# EasyEDA schematic 1-Schematic_Placa Final ALS.json
TITLE: Sheet_1; REV: 1.0; Date: 2024-05-12; Sheet: 1/1; Drawn By: Fernando Freitas; Company: Your Company
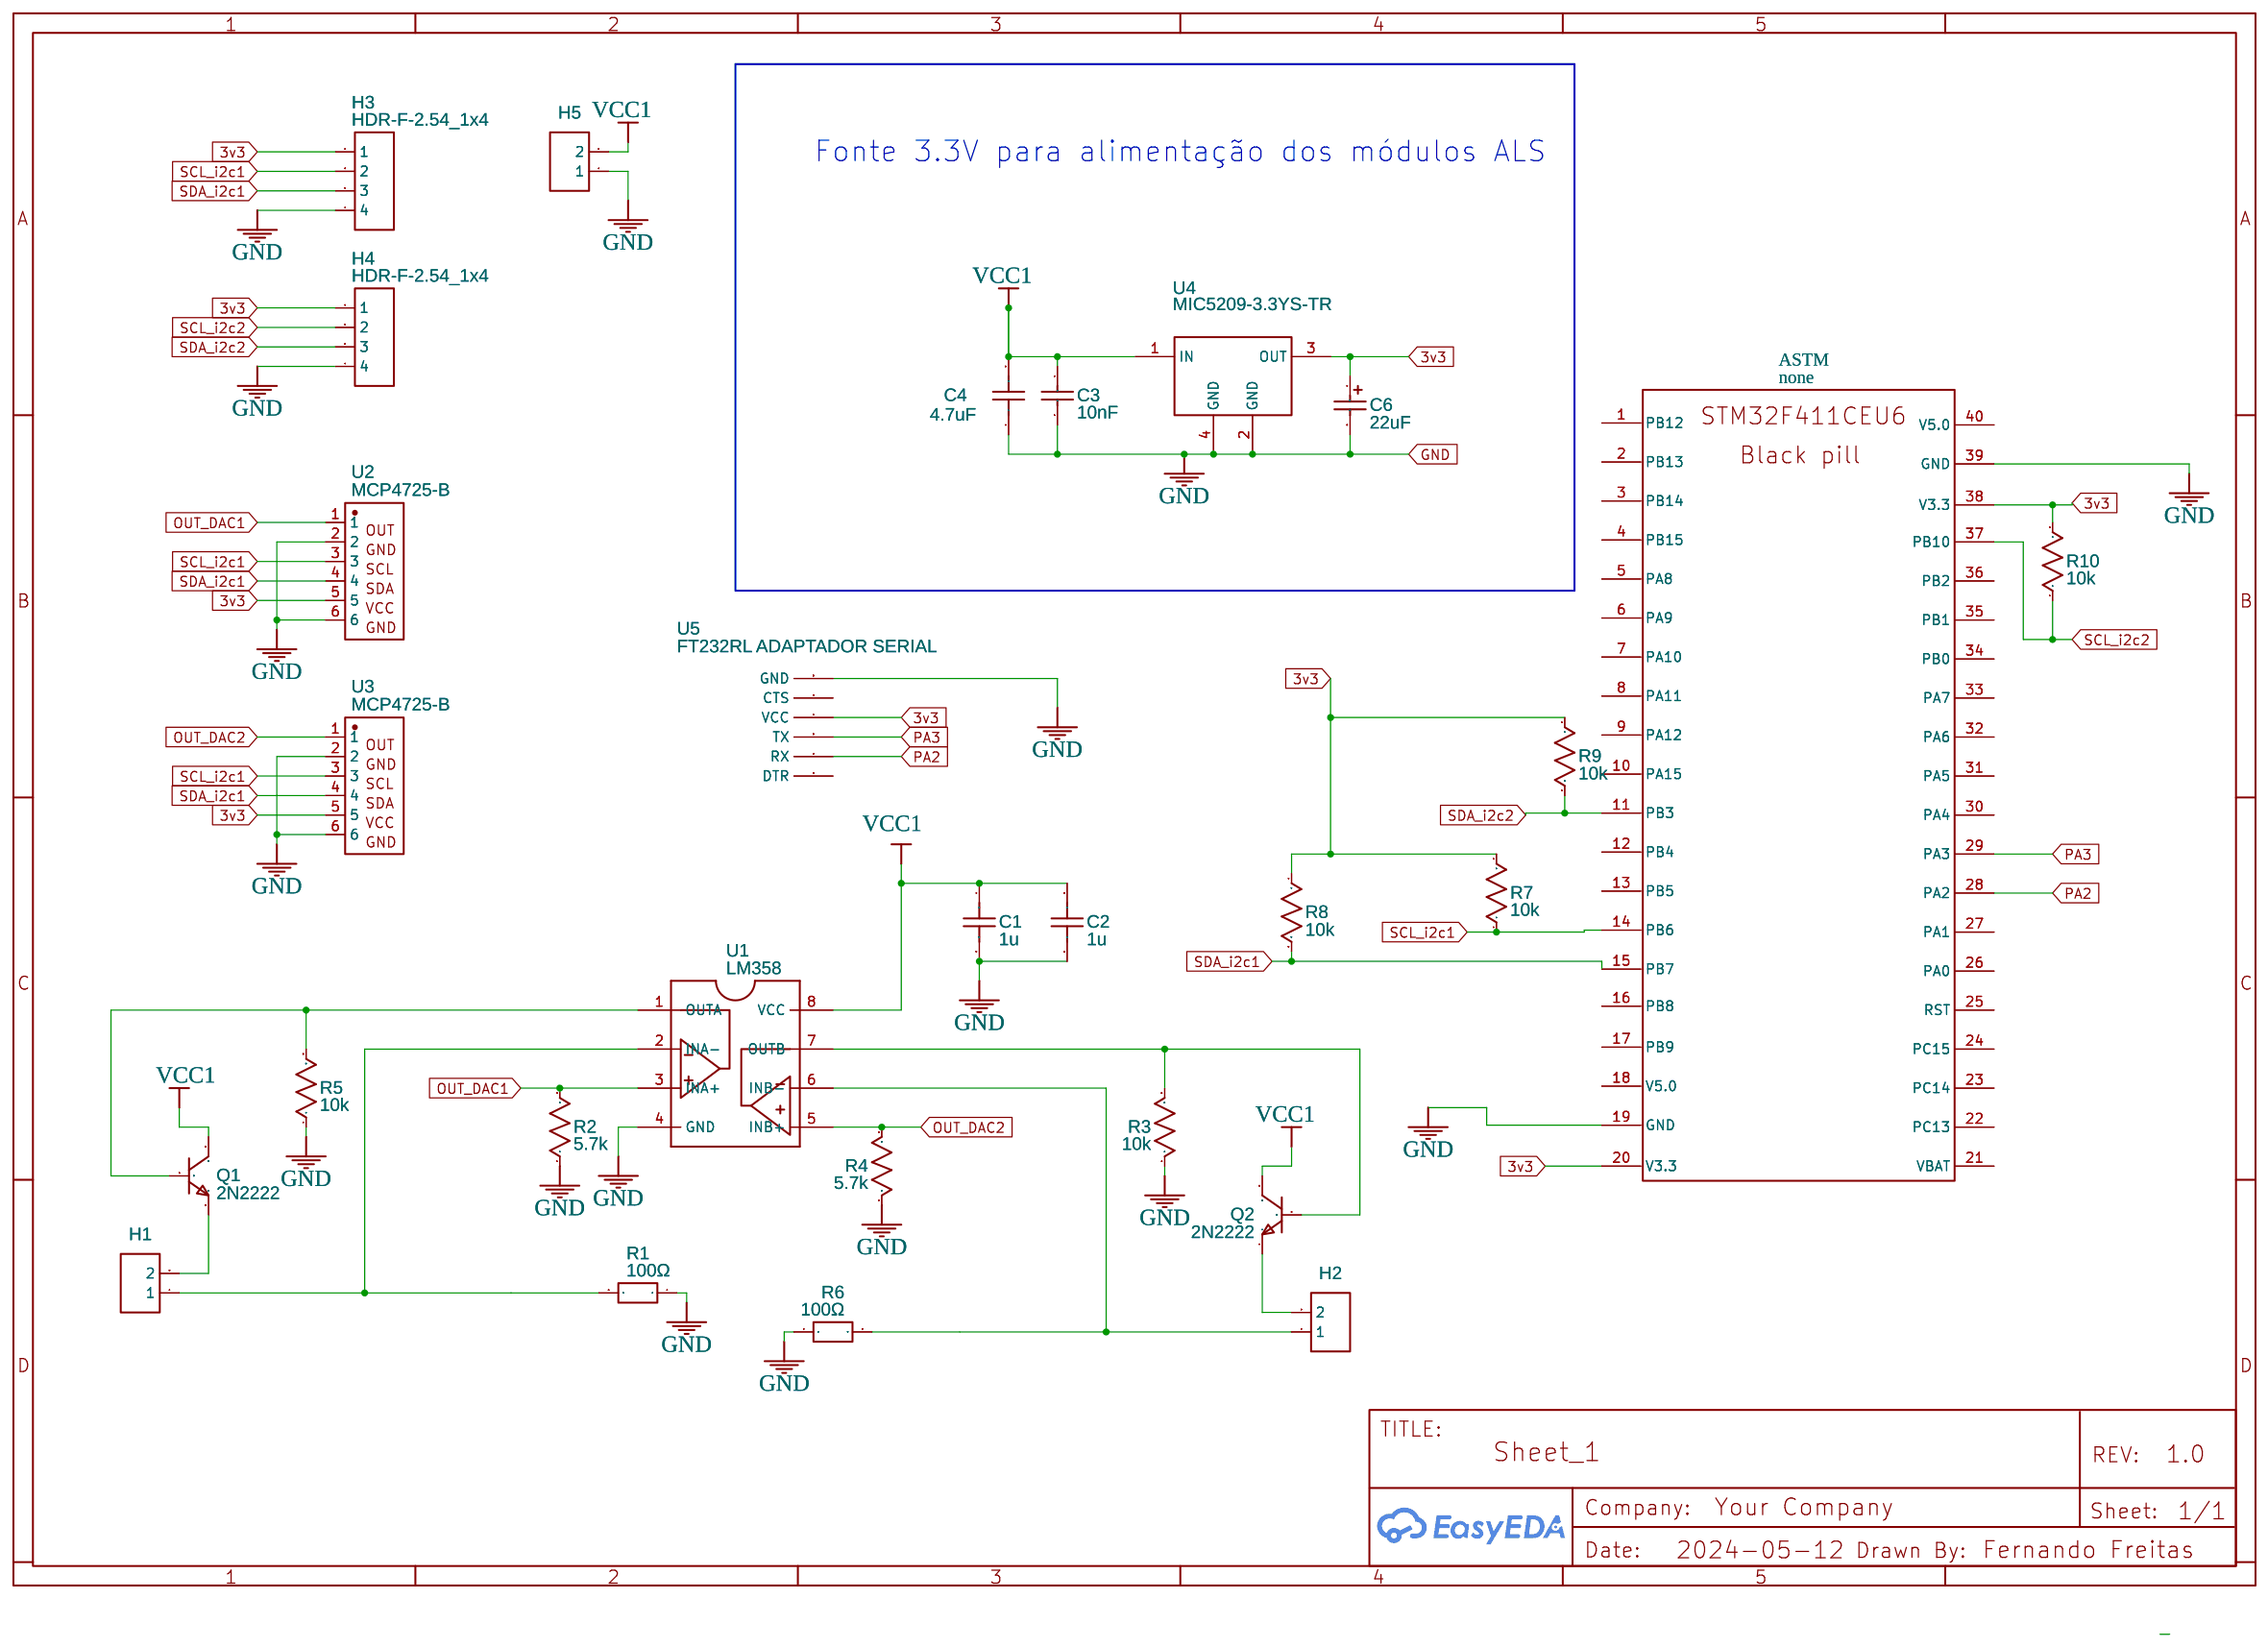
[diagram p0: schematic sheet]

## Parts
ASTM  none  [BLACKPILL LP]
C1  1u  [RAD-0.2]
C2  1u  [RAD-0.2]
C3  10nF  [RAD-0.2]
C4  4.7uF  [RAD-0.2]
C6  22uF  [RAD-0.2]
H1  HDR-F-2.54_1x2  [CONN-TH_JST2PIN]
H2  HDR-F-2.54_1x2  [CONN-TH_JST2PIN]
H3  HDR-F-2.54_1x4  [CONN-TH_4P-P2.50_JST_B4B-XH-A-M]
H4  HDR-F-2.54_1x4  [CONN-TH_4P-P2.50_JST_B4B-XH-A-M]
H5  HDR-F-2.54_1x2  [CONN-TH_JST2PIN]
Q1  2N2222  [TO-92-3_L4.9-W3.7-P1.27-L]
Q2  2N2222  [TO-92-3_L4.9-W3.7-P1.27-L]
R1  100Ω  [RES-TH_BD2.4-L6.3-P10.30-D0.6]
R2  5.7k  [RES-TH_BD2.4-L6.3-P10.30-D0.6]
R3  10k  [RES-TH_BD2.4-L6.3-P10.30-D0.6]
R4  5.7k  [RES-TH_BD2.4-L6.3-P10.30-D0.6]
R5  10k  [RES-TH_BD2.4-L6.3-P10.30-D0.6]
R6  100Ω  [RES-TH_BD2.4-L6.3-P10.30-D0.6]
R7  10k  [RES-TH_BD2.4-L6.3-P10.30-D0.6]
R8  10k  [RES-TH_BD2.4-L6.3-P10.30-D0.6]
R9  10k  [RES-TH_BD2.4-L6.3-P10.30-D0.6]
R10  10k  [RES-TH_BD2.4-L6.3-P10.30-D0.6]
U1  LM358  [DIP-8-P2.54-L10.4-W10.4]
U2  MCP4725-B  [MCP4725-B]
U3  MCP4725-B  [MCP4725-B]
U4  MIC5209-3.3YS-TR  [SOT-223-4_L6.5-W3.5-P2.30-LS7.0-BR]
U5  FT232RL ADAPTADOR SERIAL  [FT232RL]

## Library data of the parts
C1 C2 = C_RAD-0.3_US: Contributor: LCEDA_Lib
C3 = CL21B103KBANNNC: Supplier: LCSC; Manufacturer: SAMSUNG(三星); Supplier Part: C1710; JLCPCB Part Class: Basic Part; link: https://lcsc.com/eda_search?q=C1710&%26type=1&ref=editor
C4 = CGA3E2X8R1E104M080 AA: Contributor: lcsc; Supplier: LCSC; Supplier Part: C3879841; Manufacturer: TDK; Manufacturer Part: CGA3E2X8R1E104M080AA; link: https://lcsc.com/eda_search?q=C3879841&%26type=1&ref=editor
C6 = TAJB226K016RNJ: Supplier: LCSC; Manufacturer: Kyocera AVX; Supplier Part: C8020; JLCPCB Part Class: Extended Part; link: https://lcsc.com/eda_search?q=C8020&%26type=1&ref=editor
H1 H2 H5 = HDR-F-2.54_1x2: Supplier Part: C49661; Supplier: LCSC; Contributor: LCEDA_Lib; Package Display: No
H3 H4 = HDR-F-2.54_1x4: Supplier Part: C225501; Supplier: LCSC; Contributor: LCEDA_Lib
Q1 Q2 = 2N2222: Contributor: LCSC; Supplier: LCSC; Manufacturer: ST(先科); Manufacturer Part: 2N2222A; Supplier Part: C118536; JLCPCB Part Class: Extended Part
R1 R6 = 100R 1/4W: Contributor: LCSC; Supplier: LCSC; Supplier Part: C410697; Manufacturer: Tyohm(幸亚电阻); Manufacturer Part: RN 1/4W 100R F T/B A1; JLCPCB Part Class: Extended Part
R2-R5 R7-R10 = R_AXIAL-0.3_US: Contributor: LCEDA_Lib; Package Display: No
U1 = LM358: Manufacturer: LM358MX/NOPB; Manufacturer Part: TI; subpart_no: 2; image: http://image.lceda.cn/szlcsc/C16416.jpg; JLCPCB Part Class: Extended Part; Contributor: LHKhoo
U2 U3 = MCP4725-B: Supplier: LCSC; Supplier Part: C225258; Manufacturer: Changjiang Connectors; Manufacturer Part: A2005WV-6P; Contributor: Евгений Нечитайлов
U4 = TLE42744GSV33: Supplier: LCSC; Manufacturer: Infineon(英飞凌); Supplier Part: C123093; JLCPCB Part Class: Extended Part; link: https://lcsc.com/eda_search?q=C123093&%26type=1&ref=editor
U5 = FT232RL ADAPTADOR SERIAL: Manufacturer: WILSON PEREZ; Manufacturer Part: WILSON; Contributor: Wilsonperez

## Nets
3v3: ASTM.20(V3.3) ASTM.38(V3.3) C6.1 H3.1 H4.1 R7.2 R8.1 R9.1 R10.2 U2.5 U3.5 U4.3(OUT) U5.4(VCC)
GND: ASTM.19(GND) ASTM.39(GND) C1.2 C2.2 C3.1 C4.1 C6.2 H3.4 H4.4 H5.1 R1.1 R2.1 R3.1 R4.1 R5.1 R6.1 U1.4(GND) U2.2 U2.6 U3.2 U3.6 U4.2(GND) U4.4(GND) U5.6(GND)
VCC1: C1.1 C2.1 C3.2 C4.2 H5.2 Q1.3(C) Q2.3(C) U1.8(VCC) U4.1(IN)
OUT_DAC1: R2.2 U1.3(INA+) U2.1
OUT_DAC2: R4.2 U1.5(INB+) U3.1
PA2: ASTM.28(PA2) U5.2(RX)
PA3: ASTM.29(PA3) U5.3(TX)
SCL_i2c1: ASTM.14(PB6) H3.2 R7.1 U2.3 U3.3
SCL_i2c2: ASTM.37(PB10) H4.2 R10.1
SDA_i2c1: ASTM.15(PB7) H3.3 R8.2 U2.4 U3.4
SDA_i2c2: ASTM.11(PB3) H4.3 R9.2
Net-(H1-1): H1.1 R1.2 U1.2(INA-)
Net-(H1-2): H1.2 Q1.1(E)
Net-(H2-1): H2.1 R6.2 U1.6(INB-)
Net-(H2-2): H2.2 Q2.1(E)
Net-(Q1-2): Q1.2(B) R5.2 U1.1(OUTA)
Net-(Q2-2): Q2.2(B) R3.2 U1.7(OUTB)

Not connected (* = marked no-connect by the designer): ASTM 1(PB12) 2(PB13) 3(PB14) 4(PB15) 5(PA8) 6(PA9) 7(PA10) 8(PA11) 9(PA12) 10(PA15) 12(PB4) 13(PB5) 16(PB8) 17(PB9) 18(V5.0) 21(VBAT) 22(PC13) 23(PC14) 24(PC15) 25(RST) 26(PA0) 27(PA1) 30(PA4) 31(PA5) 32(PA6) 33(PA7) 34(PB0) 35(PB1) 36(PB2) 40(V5.0); U5 1(DTR) 5(CTS)

## Notes on the sheet
- Fonte 3.3V para alimentação dos módulos ALS
